# Altium schematic sheet TSMP22v1.SchDoc
size A4
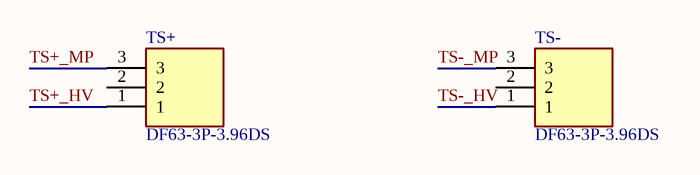
[diagram p0: TSMP22v1.SchDoc]

## Parts
TS+  DF63-3P-3.96DS  [DF633P396DS]
TS-  DF63-3P-3.96DS  [DF633P396DS]

## Nets
TS+_HV: TS+.1
TS+_MP: TS+.3
TS-_HV: TS-.1
TS-_MP: TS-.3

Not connected (* = marked no-connect by the designer): TS+ 2; TS- 2

## Library data of the parts
TS+ TS- = DF63-3P-3.96DS: Connector; Manufacturer_Name: Hirose; Datasheet Link: https://www.mouser.co.uk/datasheet/2/185/DF63_catalog-1066197.pdf; Height: 10mm; Manufacturer_Part_Number: DF63-3P-3.96DS